# EasyEDA Pro project IPM.eprj

# Schematic Schematic1
Board Name: Board1; Create Date: 2025-09-05; Page Name: P1; Project Name: IPM; Schematic Name: Schematic1; Update Date: 2025-10-12; Company: 嘉立创EDA; Page Size: A4; Version: V1.0
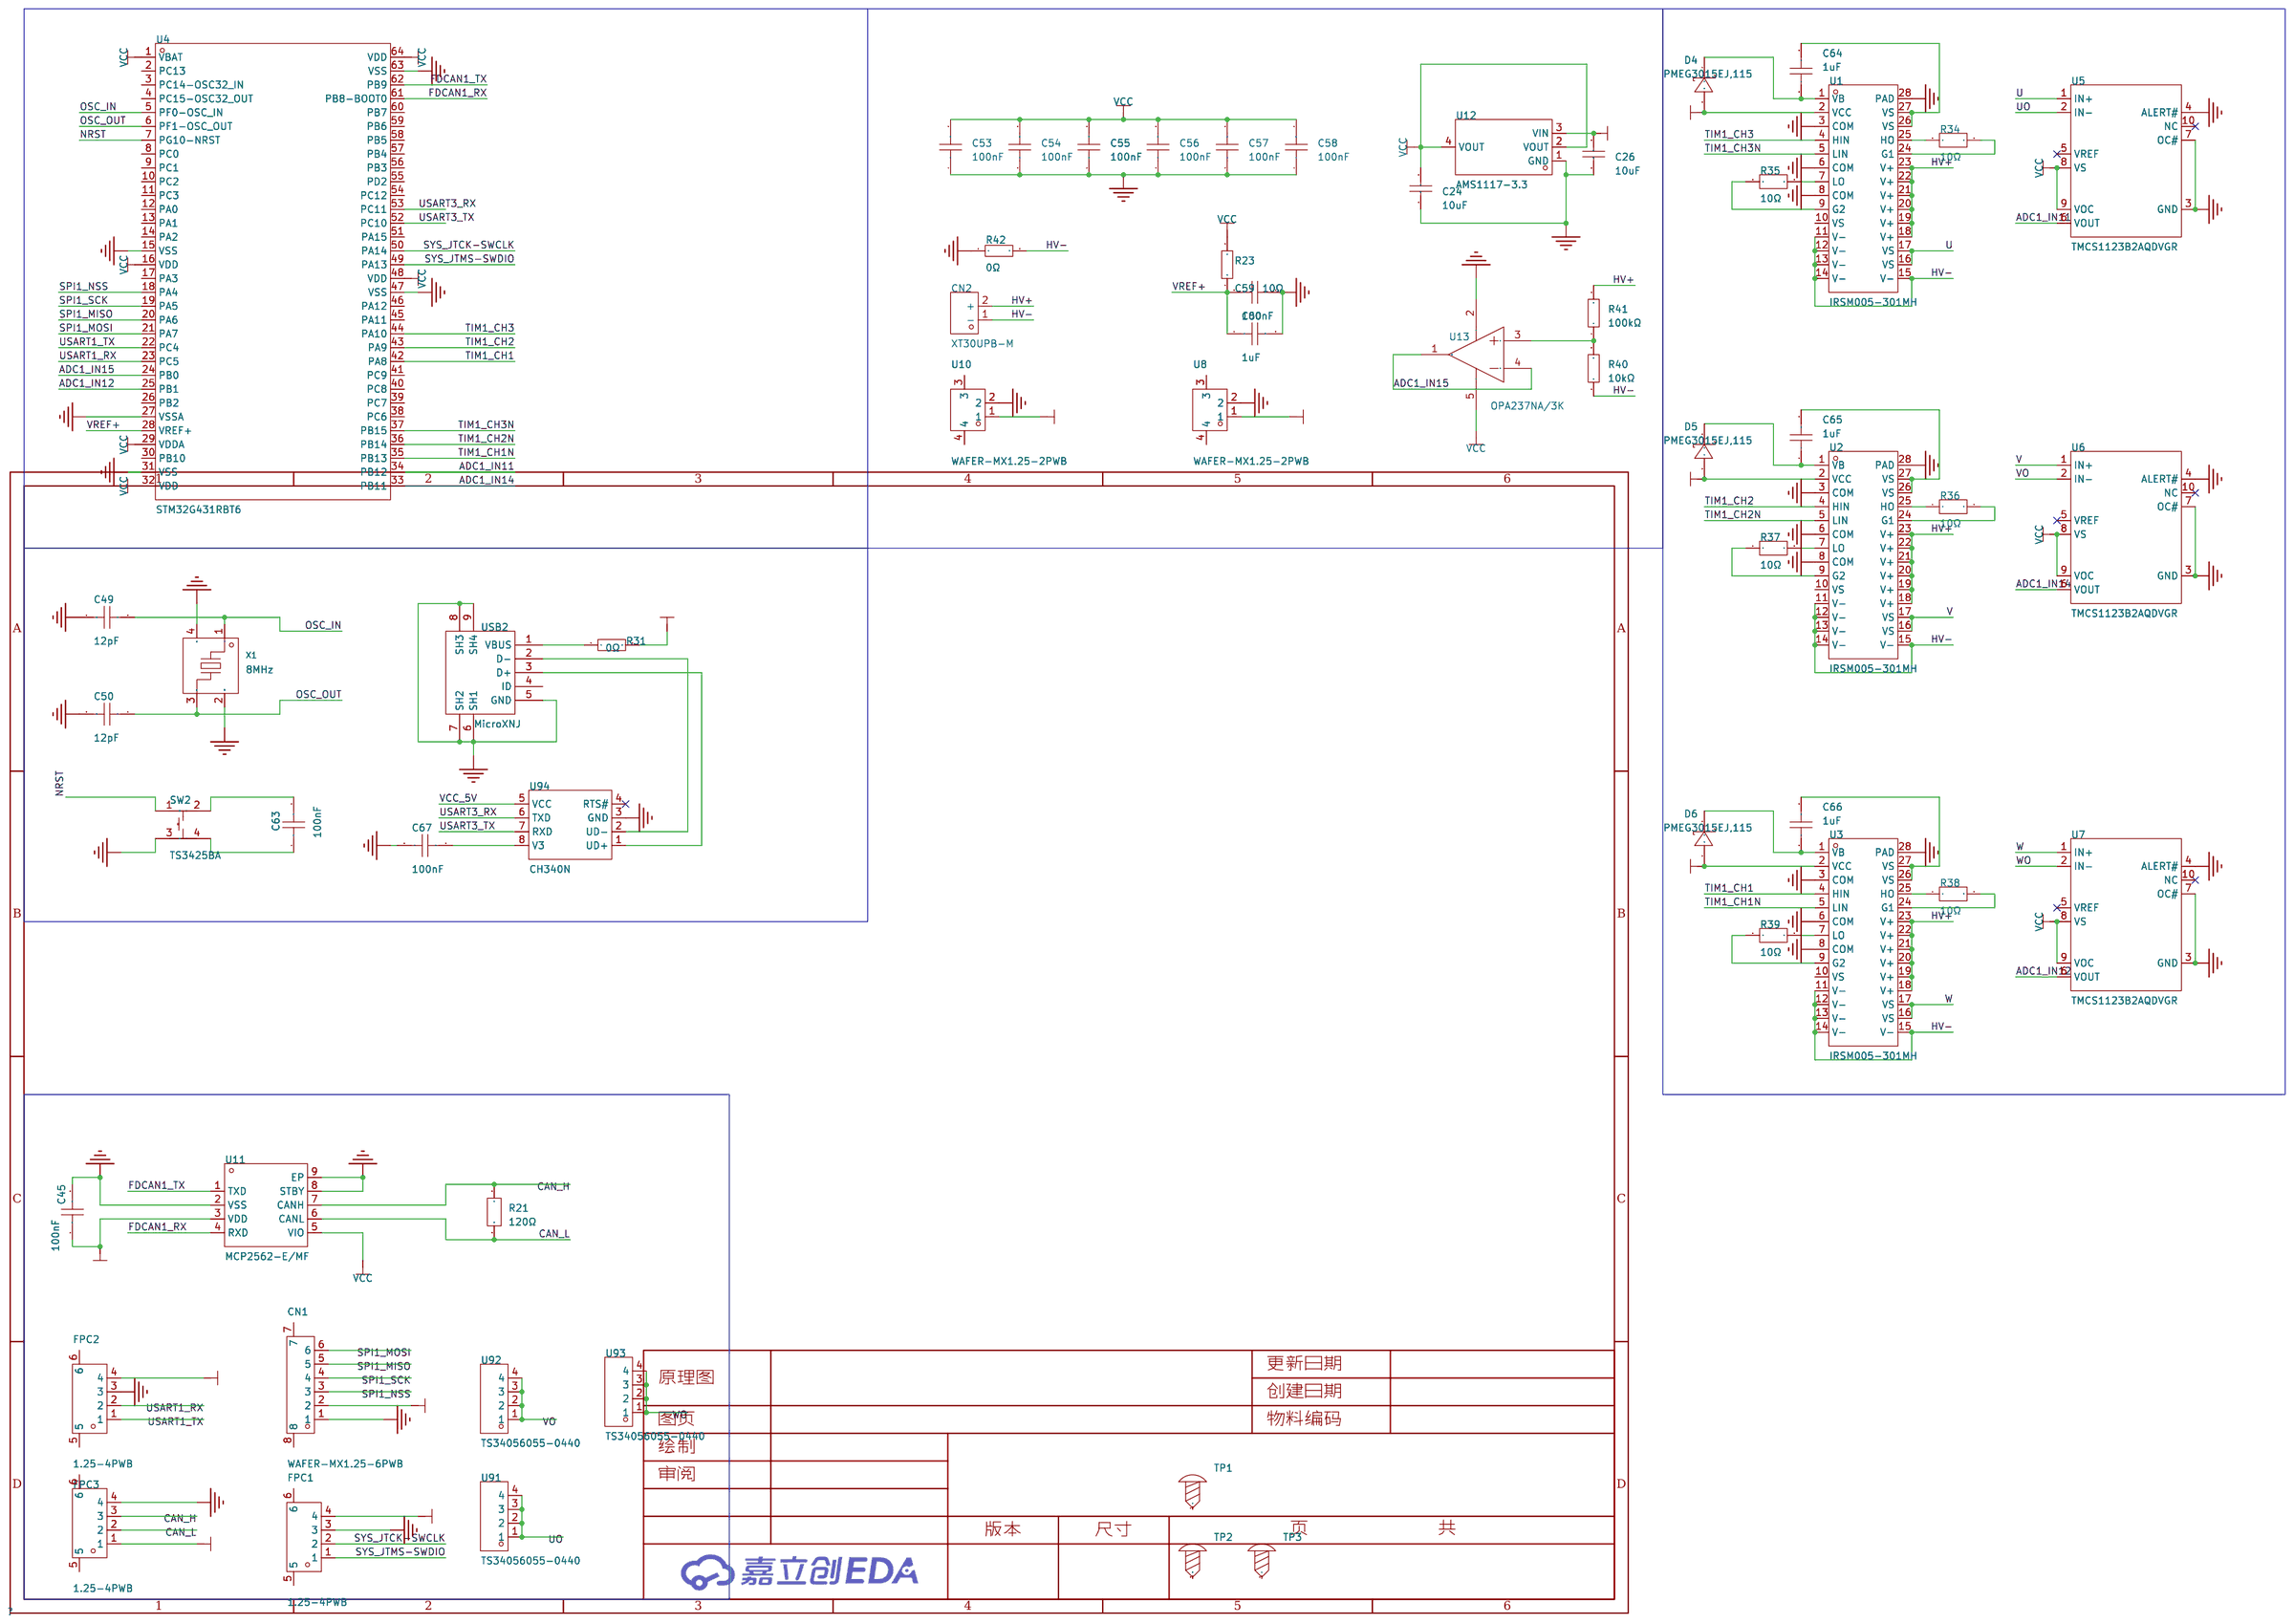
[diagram p0: schematic sheet]

## Parts
C24  10uF  [C0603]
C26  10uF  [C0603]
C45  100nF  [C0603]
C49  12pF  [C0603]
C50  12pF  [C0603]
C53  100nF  [C0603]
C54  100nF  [C0603]
C55  100nF  [C0603]
C56  100nF  [C0603]
C57  100nF  [C0603]
C58  100nF  [C0603]
C59  100nF  [C0603]
C60  1uF  [C0603]
C63  100nF  [C0603]
C64  1uF  [C0603]
C65  1uF  [C0603]
C66  1uF  [C0603]
C67  100nF  [C0603]
CN1  WAFER-MX1.25-6PWB  [CONN-SMD_6P-P1.25_XUNPU_WAFER-MX1.25-6PWB]
CN2  XT30UPB-M  [CONN-TH_XT30UPB-M]
D4  PMEG3015EJ,115  [SOD-323F_L1.7-W1.3-LS2.5-R-RD]
D5  PMEG3015EJ,115  [SOD-323F_L1.7-W1.3-LS2.5-R-RD]
D6  PMEG3015EJ,115  [SOD-323F_L1.7-W1.3-LS2.5-R-RD]
FPC1  1.25-4PWB  [CONN-SMD_1.25-4PWB]
FPC2  1.25-4PWB  [CONN-SMD_1.25-4PWB]
FPC3  1.25-4PWB  [CONN-SMD_1.25-4PWB]
R21  120Ω  [R0603]
R23  10Ω  [R0603]
R31  0Ω  [R0603]
R34  10Ω  [R0603]
R35  10Ω  [R0603]
R36  10Ω  [R0603]
R37  10Ω  [R0603]
R38  10Ω  [R0603]
R39  10Ω  [R0603]
R40  10kΩ  [R0603]
R41  100kΩ  [R0603]
R42  0Ω  [R0805]
SW2  TS3425BA  [SW-SMD_4P-L4.2-W3.2-P2.15-LS4.6-1]
TP1  -  [M2螺丝]
TP2  -  [M2螺丝]
TP3  -  [M2螺丝]
U1  IRSM005-301MH  [PQFN-27_IRSM005-800MHTR]
U2  IRSM005-301MH  [PQFN-27_IRSM005-800MHTR]
U3  IRSM005-301MH  [PQFN-27_IRSM005-800MHTR]
U4  STM32G431RBT6  [LQFP-64_L10.0-W10.0-P0.50-LS12.0-BL]
U5  TMCS1123B2AQDVGR  [SOIC-10_L10.3-W7.5-P1.27-LS10.3-BL]
U6  TMCS1123B2AQDVGR  [SOIC-10_L10.3-W7.5-P1.27-LS10.3-BL]
U7  TMCS1123B2AQDVGR  [SOIC-10_L10.3-W7.5-P1.27-LS10.3-BL]
U8  WAFER-MX1.25-2PWB  [CONN-SMD_2P-P1.25_XUNPU_WAFER-MX1.25-2PWB]
U10  WAFER-MX1.25-2PWB  [CONN-SMD_2P-P1.25_XUNPU_WAFER-MX1.25-2PWB]
U11  MCP2562-E/MF  [DFN-8_L3.0-W3.0-P0.65-BL-EP]
U12  AMS1117-3.3  [SOT-223-3_L6.5-W3.4-P2.30-LS7.0-BR]
U13  OPA237NA/3K  [SOT-23-5_L3.0-W1.7-P0.95-LS2.8-BR]
U91  TS34056055-0440  [SMD-4_TS34056055-0440]
U92  TS34056055-0440  [SMD-4_TS34056055-0440]
U93  TS34056055-0440  [SMD-4_TS34056055-0440]
U94  CH340N  [SOP-8_L4.9-W3.9-P1.27-LS6.0-BL]
USB2  MicroXNJ  [MICRO-USB-SMD_MICROXNJ]
X1  8MHz  [OSC-SMD_4P-L3.2-W2.5-BL]

## Library data of the parts
C24 C26 = 0603X106K100: 容值:10uF;精度:±10%;额定电压:10V;材质(温度系数):X5R;; LCSC Part Name: 10uF ±10% 10V; Supplier Part: C90806; Manufacturer: Walsin(华新科); Supplier Footprint: 0603; JLCPCB Part Class: 扩展库; Datasheet: https://atta.szlcsc.com/upload/public/pdf/source/20170726/C90806_1501054746849844281.pdf; Supplier: LCSC; Tolerance: ±10%; Voltage Rated: 10V; Temperature Coefficient: X5R
C45 C53-C59 C63 = CC0603KRX7R9BB104: 容值:100nF;精度:±10%;额定电压:50V;材质(温度系数):X7R;; LCSC Part Name: 100nF ±10% 50V; Supplier Part: C14663; Manufacturer: YAGEO(国巨); Supplier Footprint: 0603; JLCPCB Part Class: 基础库; Datasheet: https://atta.szlcsc.com/upload/public/pdf/source/20180910/C282072_33301C7F631E79921B82A8DAC6BCC5B3.pdf; Supplier: LCSC; Tolerance: ±10%; Voltage Rated: 50V; Temperature Coefficient: X7R
C49 C50 = CC0603FRNPO9BN120: 容值:12pF;精度:±1%;额定电压:50V;材质(温度系数):NP0;; LCSC Part Name: 12pF ±1% 50V; Supplier Part: C519482; Manufacturer: YAGEO(国巨); Supplier Footprint: 0603; JLCPCB Part Class: Extended Part; Datasheet: https://atta.szlcsc.com/upload/public/pdf/source/20200423/C519482_89049CE53433C44DEC6365B4D6A7EBAA.pdf; Supplier: LCSC; Tolerance: ±1%; Voltage Rated: 50V; Temperature Coefficient: NP0
C60 = CC0603JRX7R6BB105: 容值:1uF;精度:±5%;额定电压:10V;材质(温度系数):X7R;; LCSC Part Name: 1uF ±5% 10V; Supplier Part: C519559; Manufacturer: YAGEO(国巨); Supplier Footprint: 0603; JLCPCB Part Class: Extended Part; Datasheet: https://atta.szlcsc.com/upload/public/pdf/source/20200423/C519559_6C4B5FFAE74A7C54887BF5D296B4B550.pdf; Supplier: LCSC; Tolerance: ±5%; Voltage Rated: 10V; Temperature Coefficient: X7R
C64-C66 = CL10A105KB8NNNC: LCSC Part Name: 1uF ±10% 50V; Supplier Part: C15849; Manufacturer: SAMSUNG(三星); Supplier Footprint: 0603; JLCPCB Part Class: 基础库; Datasheet: https://item.szlcsc.com/datasheet/CL10A105KB8NNNC/16531.html; Supplier: LCSC; Tolerance: ±10%; Voltage Rating: 50V; Temperature Coefficient: X5R
C67 = FCC0603B104K500CT: 容值:100nF;精度:±10%;额定电压:50V;温度系数:X7R;; LCSC Part Name: 100nF ±10% 50V; Supplier Part: C5137636; Manufacturer: FOJAN(富捷); Supplier Footprint: 0603; JLCPCB Part Class: 扩展库; Datasheet: https://item.szlcsc.com/datasheet/FCC0603B104K500CT/5747088.html; Supplier: LCSC; Tolerance: ±10%; Voltage Rating: 50V; Temperature Coefficient: X7R
CN1 = WAFER-MX1.25-6PWB: LCSC Part Name: 1x6P 间距:1.25mm 卧贴 系列:PicoBlade(MX 1.25); Supplier Part: C3029363; Manufacturer: XUNPU(讯普); Supplier Footprint: SMD,P=1.25mm,卧贴; JLCPCB Part Class: 扩展库; Datasheet: https://item.szlcsc.com/datasheet/WAFER-MX1.25-6PWB/3561375.html; Supplier: LCSC; Pins Structure: 1x6P; Pitch: 1.25mm; Mounting Type: 卧贴; Reference Series: PicoBlade(MX 1.25); Number of Pins: 6P; Number of Rows: 1; Number of PINs Per Row: 6; Current Rating: 1A; Contact Material: 黄铜; Operating Temperature: -25℃~+85℃; Voltage Rating: 125V; Plastic Material: LCP; Supplementary Features: 辅助焊脚; Color: 米色; Z-Height of the Board: 3.6mm; X-Length of Bottom Edge on Board (Spacing Line): 12.5mm; Y-Width of Bottom Edge on Board: 5.25mm
CN2 = XT30UPB-M: LCSC Part Name: AMASS(艾迈斯)板载立式 航模锂电池控制器连接器插头 公头XT30UPB-M; Supplier Part: C428721; Manufacturer: AMASS(艾迈斯); JLCPCB Part Class: 扩展库; Datasheet: https://item.szlcsc.com/datasheet/XT30UPB-M/423831.html; Supplier: LCSC; Type: 航模插头; Colour: 黄色; RatedVoltage: DC 500V; InterfaceType: 公头; MetalMaterial: 镀金; InsulationMaterial: PA; RatedCurrent: 15A; contact resistance: 0.65mΩ
D4-D6 = PMEG3015EJ,115: LCSC Part Name: 电压:30V 电流:1.5A; Supplier Part: C426865; Manufacturer: Nexperia(安世); Supplier Footprint: SOD-323F; JLCPCB Part Class: 扩展库; Datasheet: https://item.szlcsc.com/datasheet/PMEG3015EJ%252C115/420884.html; Supplier: LCSC; Diode Configuration: 1个独立式; Voltage - Forward(Vf@If): 550mV@1.5A; Voltage - DC Reverse(Vr): 30V; Current - Rectified: 1.5A; Reverse Leakage Current (Ir): 1mA@30V; Non-Repetitive Peak Forward Surge Current: 9A
FPC1-FPC3 = 1.25-4PWB: LCSC Part Name: 1x4P 间距:1.25mm 卧贴 系列:PicoBlade(MX 1.25); Supplier Part: C2905011; Manufacturer: DEALON(德艺隆); Supplier Footprint: SMD,P=1.25mm,卧贴; JLCPCB Part Class: 扩展库; Datasheet: https://item.szlcsc.com/datasheet/1.25-4PWB/3172296.html; Supplier: LCSC; Pins Structure: 1x4P; Pitch: 1.25mm; Mounting Type: 卧贴; Reference Series: PicoBlade(MX 1.25); Number of Pins: 4P; Number of Rows: 1; Number of PINs Per Row: 4; Current Rating: 1A; Contact Material: 黄铜; Contact Plating: 锡; Operating Temperature: -25℃~+85℃; Voltage Rating: 125V; Plastic Material: LCP; Flame Retardant Rating: UL94V-0; Supplementary Features: 辅助焊脚; Color: 米色
R21 = AR03BTCX1200: 电阻类型:薄膜电阻;阻值:120Ω;精度:±0.1%;功率:100mW;; LCSC Part Name: 120Ω ±0.1% 100mW; Supplier Part: C2828631; Manufacturer: Viking(光颉); Supplier Footprint: 0603; JLCPCB Part Class: 扩展库; Datasheet: https://atta.szlcsc.com/upload/public/pdf/source/20211009/C2828631_CB7E5025206F65E2B3DE5440F8A20222.pdf; Supplier: LCSC; Type: 薄膜电阻; Tolerance: ±0.1%; Power(Watts): 100mW; Temperature Coefficient: ±25ppm/℃; Overload Voltage (Max): 50V; Operating Temperature Range: -55℃~+155℃
R23 = 0603WAF100JT5E: 电阻类型:厚膜电阻;阻值:10Ω;精度:±1%;功率:100mW;; LCSC Part Name: 10Ω ±1% 100mW; Supplier Part: C22859; Manufacturer: UNI-ROYAL(厚声); Supplier Footprint: 0603; JLCPCB Part Class: 基础库; Datasheet: https://atta.szlcsc.com/upload/public/pdf/source/20200306/C422600_1E6D84923E4A46A82E41ADD87F860B5C.pdf; Supplier: LCSC; Type: 厚膜电阻; Tolerance: ±1%; Power(Watts): 100mW; Temperature Coefficient: ±400ppm/℃; Overload Voltage (Max): 75V; Operating Temperature Range: -55℃~+155℃
R31 = 0603WAF0000T5E: 电阻类型:厚膜电阻;阻值:0Ω;精度:±1%;功率:100mW;最大工作电压:75V;; LCSC Part Name: 0Ω ±1% 100mW 厚膜电阻; Supplier Part: C21189; Manufacturer: UNI-ROYAL(厚声); Supplier Footprint: 0603; JLCPCB Part Class: 基础库; Datasheet: https://atta.szlcsc.com/upload/public/pdf/source/20200306/C422600_1E6D84923E4A46A82E41ADD87F860B5C.pdf; Supplier: LCSC; Type: 厚膜电阻; Tolerance: ±1%; Power(Watts): 100mW; Overload Voltage (Max): 75V; Operating Temperature Range: -55℃~+155℃
R34-R39 = HoARG0603-1/10W-10R-0.1%-TCR25: LCSC Part Name: 陶瓷电阻 10Ω ±0.1% 100mW; Supplier Part: C5123611; Manufacturer: Milliohm(毫欧); Supplier Footprint: 0603; JLCPCB Part Class: 扩展库; Datasheet: https://atta.szlcsc.com/upload/public/pdf/source/20220810/6C2B79E0158B8955D0E7C03ADBB11263.pdf; Supplier: LCSC; Type: 陶瓷电阻; Tolerance: ±0.1%; Power(Watts): 100mW; Temperature Coefficient: ±25ppm/℃
R40 = RT0603BRD0710KL: LCSC Part Name: 薄膜电阻 10kΩ ±0.1% 100mW; Supplier Part: C95204; Manufacturer: YAGEO(国巨); Supplier Footprint: 0603; JLCPCB Part Class: 扩展库; Datasheet: https://atta.szlcsc.com/upload/public/pdf/source/20250609/0E6D5617EADA80FA3B707391883DF2D5.pdf; Supplier: LCSC; Type: 薄膜电阻; Tolerance: ±0.1%; Power(Watts): 100mW; Voltage-Supply(Max): 75V; Temperature Coefficient: ±25ppm/℃; Operating Temperature: -55℃~+155℃
R41 = RT0603BRD07100KL: LCSC Part Name: 薄膜电阻 100kΩ ±0.1% 100mW; Supplier Part: C122538; Manufacturer: YAGEO(国巨); Supplier Footprint: 0603; JLCPCB Part Class: 扩展库; Datasheet: https://atta.szlcsc.com/upload/public/pdf/source/20170721/C122538_1500619326323834092.pdf; Supplier: LCSC; Type: 薄膜电阻; Tolerance: ±0.1%; Power(Watts): 100mW; Overload Voltage (Max): 75V; Temperature Coefficient: ±25ppm/℃; Operating Temperature Range: -55℃~+155℃
R42 = 0805W8F0000T5E: LCSC Part Name: 0Ω ±1% 125mW 厚膜电阻; Supplier Part: C17477; Manufacturer: UNI-ROYAL(厚声); Supplier Footprint: 0805; JLCPCB Part Class: 基础库; Datasheet: https://item.szlcsc.com/datasheet/0805W8F0000T5E/18165.html; Supplier: LCSC; Type: 厚膜电阻; Tolerance: ±1%; Power(Watts): 125mW; Voltage-Supply(Max): 150V; Temperature Coefficient: ±800ppm/℃; Operating Temperature: -55℃~+155℃
SW2 = TS3425BA: LCSC Part Name: 4.2*3.2*2.5mm 立贴 轻触开关; Supplier Part: C2681476; Manufacturer: SHOU HAN(首韩); Supplier Footprint: SMD; JLCPCB Part Class: 扩展库; Datasheet: https://item.szlcsc.com/datasheet/TS3425BA/2774819.html; Supplier: LCSC; Circuit: 单刀单掷; Actuator Style: 椭圆形按钮; Operating Force: 2.5N; Mounting Type: 立贴; Length: 4.2mm; Width: 3.2mm; Switch Height: 2.5mm; with Bracket: 不带支架; Contact Current: 50mA; Voltage Rating: 12V; Actuator/Cap Color: 白色; Termination Style: J型引脚; Life: 10万次; Operating Temperature: -20℃~+85℃
TP1-TP3 = M2螺丝: Supplier Footprint: 插件
U1-U3 = IRSM005-301MH: Supplier Part: C538363; Manufacturer: Infineon(英飞凌); Supplier Footprint: PQFN-27; JLCPCB Part Class: 扩展库; Datasheet: https://item.szlcsc.com/datasheet/IRSM005-301MH/558706.html; Supplier: LCSC; Driven Configuration: 半桥; Load Type: MOSFET; Number of Drivers: 2; Voltage - Supply: 10V~20V; Rise Time: 70ns; Fall Time: 35ns; Propagation Delay tpLH: 160ns; Propagation Delay tpHL: 150ns; Features: 欠压保护(UVP); Quiescent Current(Iq): 150uA
U4 = STM32G431RBT6: LCSC Part Name: 带DSP和FPU的170MHz主流ARM Cortex-M4 MCU，具有128 KB Flash存储器、数学加速器和中等模拟电平集成; Supplier Part: C431633; Manufacturer: ST(意法半导体); Supplier Footprint: LQFP-64(10x10); JLCPCB Part Class: 扩展库; Datasheet: https://item.szlcsc.com/datasheet/STM32G431RBT6/428111.html; Supplier: LCSC; CPU Core: ARM-M系列; CPU Maximum Speed: 170MHz; Program Storage Size: 128KB; Number of I/O: 52; ADC (Bit): 12bit; DAC (Bit): 12bit; Voltage - Supply: 1.71V~3.6V
U5-U7 = TMCS1123B2AQDVGR: Supplier Part: C34837986; Manufacturer: TI(德州仪器); Supplier Footprint: SOIC-10; JLCPCB Part Class: 扩展库; Datasheet: https://www.ti.com.cn/cn/lit/ds/symlink/tmcs1123.pdf?ts=1749086202716; Supplier: LCSC
U8 U10 = WAFER-MX1.25-2PWB: LCSC Part Name: 1x2P 间距:1.25mm 卧贴 系列:PicoBlade(MX 1.25); Supplier Part: C3029359; Manufacturer: XUNPU(讯普); Supplier Footprint: SMD,P=1.25mm,卧贴; JLCPCB Part Class: 扩展库; Datasheet: https://atta.szlcsc.com/upload/public/pdf/source/20220527/5ACBB683E384B6AD06743F272F933620.pdf; Supplier: LCSC; Pins Structure: 1x2P; Pitch: 1.25mm; Mounting Type: 卧贴; Reference Series: PicoBlade(MX 1.25); Number of Pins: 2P; Number of Rows: 1; Number of PINs Per Row: 2; Current Rating: 1A; Contact Material: 黄铜; Operating Temperature: -25℃~+85℃; Voltage Rating: 125V; Plastic Material: LCP; Supplementary Features: 辅助焊脚; Color: 米色; Z-Height of the Board: 3.6mm; X-Length of Bottom Edge on Board (Spacing Line): 7.5mm; Y-Width of Bottom Edge on Board: 5.25mm
U11 = MCP2562-E/MF: 类型:收发器;; Supplier Part: C635113; Manufacturer: MICROCHIP(美国微芯); Supplier Footprint: DFN-8-EP(3x3); JLCPCB Part Class: 扩展库; Datasheet: https://atta.szlcsc.com/upload/public/pdf/source/20150713/1457707330677.pdf; Supplier: LCSC; Type: 收发器; Supply Voltage: 4.5V~5.5V; Operating Temperature: -40℃~+125℃
U12 = AMS1117-3.3_C6186: 输出类型:固定;输出极性:正;最大输入电压:-;输出电压:3.3V;输出电流:1A;电源纹波抑制比(PSRR):72dB@(120Hz);; LCSC Part Name: 输出3.3V 1A; Supplier Part: C6186; Manufacturer: AMS; Supplier Footprint: SOT-223; JLCPCB Part Class: 基础库; Datasheet: https://atta.szlcsc.com/upload/public/pdf/source/20180727/C6186_7A095716F0823C02F1997A905E26C086.pdf; Supplier: LCSC; Output Type: 固定; Output Polarity: 正; Number of Outputs: 1; Output Voltage: 3.3V; Dropout Voltage: 1.3V@(800mA); Output Current: 1A; Power Supply Rejection Ratio (PSRR): 72dB@(120Hz)
U13 = OPA237NA/3K: Supplier Part: C90349; Manufacturer: TI(德州仪器); Supplier Footprint: SOT-23-5; JLCPCB Part Class: 扩展库; Datasheet: https://www.ti.com/cn/lit/gpn/opa2237; Supplier: LCSC; Number of Channels: 单路; Gain Bandwidth Product: 1.5MHz; Ib - Input Bias Current: 10nA; Vos - Input Offset Voltage: 250uV; Common Mode Rejection Ratio(CMRR): 85dB; Slew Rate: 0.5V/us; Output Current: 4mA; Rail to Rail: 轨到轨输入,轨到轨输出; Input Offset Voltage Drift(Vos TC): 2uV/℃; Quiescent Current(Iq): 350uA; Operating Temperature: -40℃~+85℃; Single Supply: 2.7V~36V; Dual Supply: -18V~-1.35V；1.35V~18V; Maximum Power Supply Range (Vdd-Vss): 36V; Noise density(eN): 28nV/√Hz@1kHz; Input Offset Current(Ios): 10nA
U91-U93 = TS34056055-0440: 螺孔规格:M3;焊脚数量:4;; LCSC Part Name: PCB焊接端子抽牙立贴M3 四脚 10*5.5*4.4mm T0.8 镀雾锡; Supplier Part: C19724594; Manufacturer: XFCN(兴飞); Supplier Footprint: SMD; JLCPCB Part Class: 扩展库; Datasheet: https://atta.szlcsc.com/upload/public/pdf/source/20231225/0D4D7DBADB53D24178026D9F36264268.pdf; Supplier: LCSC; Screw Hole Size: M3; Number of Leg: 4
U94 = CH340N: LCSC Part Name: USB2.0芯片CH340; Supplier Part: C2977777; Manufacturer: WCH(南京沁恒); Supplier Footprint: SOP-8; JLCPCB Part Class: 扩展库; Datasheet: https://atta.szlcsc.com/upload/public/pdf/source/20240313/115CDE92081B1D6CB446704AD5D0F5F2.pdf; Supplier: LCSC; Applications Function: USB转串口; Protocol: USB 2.0; Number of Channels: 1; Voltage - Supply: 3.3V；5V; Data Rate: 2Mbps; Operating Temperature: -20℃~+70℃
USB2 = MicroXNJ: 连接器类型:Micro-B;标准:USB 2.0;公母:母;安装方式:卧贴;触点数量:5P;端口数量:1;额定电流 - 电源:1A;工作温度范围:-20℃~+85℃;; LCSC Part Name: Micro-B 母 卧贴; Supplier Part: C404969; Manufacturer: SHOU HAN(首韩); Supplier Footprint: SMD; JLCPCB Part Class: 扩展库; Datasheet: https://atta.szlcsc.com/upload/public/pdf/source/20220415/2494EDFF499AF6F852F7C820374B6AF3.pdf; Supplier: LCSC; Connector Type: Micro-B; Standard: USB 2.0; Gender: 母; Mounting Style: 卧贴; Number of Contacts: 5P; Number of Ports: 1; Current Rating - Power (Max): 1A; Operating Temperature Range: -20℃~+85℃
X1 = X32258MOB4SI: 频率:8MHz;频率公差:±10ppm;负载电容:12pF;; LCSC Part Name: 8MHz ±10ppm 12pF YSX321SL; Supplier Part: C2682775; Manufacturer: YXC(扬兴晶振); Supplier Footprint: SMD3225-4P; JLCPCB Part Class: Extended Part; Datasheet: https://atta.szlcsc.com/upload/public/pdf/source/20210106/C2682774_0CD4FDA5D9DA3FBEEC23BD607A48E4B0.pdf; Supplier: LCSC; Crystal Type: 贴片无源晶振; Frequency Tolerance: ±10ppm; Frequency Stability: ±30ppm; Load Capacitance: 12pF; Equivalent Series Resistance (ESR): 150Ω; Operating Temperature: -40℃~+85℃

## Nets
GND: C24.2 C26.2 C45.2 C49.2 C50.2 C53.1 C54.1 C55.1 C56.1 C57.1 C58.1 C59.1 C60.2 C67.1 CN1.1 FPC1.3 FPC2.3 FPC3.4 R42.1 SW2.3 U1.3(COM) U1.6(COM) U1.8(COM) U1.28(PAD) U2.3(COM) U2.6(COM) U2.8(COM) U2.28(PAD) U3.3(COM) U3.6(COM) U3.8(COM) U3.28(PAD) U4.15(VSS) U4.27(VSSA) U4.31(VSS) U4.47(VSS) U4.63(VSS) U5.3(GND) U5.4(ALERT#) U5.7(OC#) U6.3(GND) U6.4(ALERT#) U6.7(OC#) U7.3(GND) U7.4(ALERT#) U7.7(OC#) U8.2 U10.2 U11.2(VSS) U11.8(STBY) U11.9(EP) U12.1(GND) U13.2(V-) U94.3(GND) USB2.5(GND) USB2.6(SH1) USB2.7(SH2) USB2.8(SH3) USB2.9(SH4) X1.2(GND) X1.4(GND)
VCC: C24.1 C53.2 C54.2 C55.2 C56.2 C57.2 C58.2 R23.2 U4.1(VBAT) U4.16(VDD) U4.29(VDDA) U4.32(VDD) U4.48(VDD) U4.64(VDD) U5.8(VS) U5.9(VOC) U6.8(VS) U6.9(VOC) U7.8(VS) U7.9(VOC) U11.5(VIO) U12.2(VOUT) U12.4(VOUT) U13.5(V+)
VCC_5V: C26.1 C45.1 CN1.2 FPC1.4 FPC2.4 FPC3.1 R31.2 U8.1 U11.3(VDD) U12.3(VIN) U94.5(VCC)
VCC_15V: D4.2 D5.2 D6.2 U1.2(VCC) U2.2(VCC) U3.2(VCC) U10.1
ADC1_IN11: U4.34(PB12) U5.6(VOUT)
ADC1_IN12: U4.25(PB1) U7.6(VOUT)
ADC1_IN14: U4.33(PB11) U6.6(VOUT)
ADC1_IN15: U4.24(PB0) U13.1(OUT) U13.4(IN-)
CAN_H: FPC3.3 R21.2 U11.7(CANH)
CAN_L: FPC3.2 R21.1 U11.6(CANL)
FDCAN1_RX: U4.61(PB8-BOOT0) U11.4(RXD)
FDCAN1_TX: U4.62(PB9) U11.1(TXD)
HV+: CN2.2(+) R41.2 U1.18(V+) U1.19(V+) U1.20(V+) U1.21(V+) U1.22(V+) U1.23(V+) U2.18(V+) U2.19(V+) U2.20(V+) U2.21(V+) U2.22(V+) U2.23(V+) U3.18(V+) U3.19(V+) U3.20(V+) U3.21(V+) U3.22(V+) U3.23(V+)
HV-: CN2.1(-) R40.1 R42.2 U1.11(V-) U1.12(V-) U1.13(V-) U1.14(V-) U1.15(V-) U2.11(V-) U2.12(V-) U2.13(V-) U2.14(V-) U2.15(V-) U3.11(V-) U3.12(V-) U3.13(V-) U3.14(V-) U3.15(V-)
NRST: SW2.1 U4.7(PG10-NRST)
OSC_IN: C49.1 U4.5(PF0-OSC_IN) X1.1
OSC_OUT: C50.1 U4.6(PF1-OSC_OUT) X1.3
SPI1_MISO: CN1.5 U4.20(PA6)
SPI1_MOSI: CN1.6 U4.21(PA7)
SPI1_NSS: CN1.3 U4.18(PA4)
SPI1_SCK: CN1.4 U4.19(PA5)
SYS_JTCK-SWCLK: FPC1.2 U4.50(PA14)
SYS_JTMS-SWDIO: FPC1.1 U4.49(PA13)
TIM1_CH1: U3.4(HIN) U4.42(PA8)
TIM1_CH1N: U3.5(LIN) U4.35(PB13)
TIM1_CH2: U2.4(HIN) U4.43(PA9)
TIM1_CH2N: U2.5(LIN) U4.36(PB14)
TIM1_CH3: U1.4(HIN) U4.44(PA10)
TIM1_CH3N: U1.5(LIN) U4.37(PB15)
U: U1.16(VS) U1.17(VS) U5.1(IN+)
UO: U5.2(IN-) U91.1 U91.2 U91.3 U91.4
USART1_RX: FPC2.2 U4.23(PC5)
USART1_TX: FPC2.1 U4.22(PC4)
USART3_RX: U4.53(PC11) U94.6(TXD)
USART3_TX: U4.52(PC10) U94.7(RXD)
V: U2.16(VS) U2.17(VS) U6.1(IN+)
VO: U6.2(IN-) U92.1 U92.2 U92.3 U92.4
VREF+: C59.2 C60.1 R23.1 U4.28(VREF+)
W: U3.16(VS) U3.17(VS) U7.1(IN+)
WO: U7.2(IN-) U93.1 U93.2 U93.3 U93.4
$1N2757: C63.2 SW2.2
$1N2759: C63.1 SW2.4
$1N4046: R31.1 USB2.1(VBUS)
$1N8993: C64.1 D4.1 U1.1(VB)
$1N9003: C64.2 U1.26(VS) U1.27(VS)
$1N9475: C65.2 U2.26(VS) U2.27(VS)
$1N9480: C65.1 D5.1 U2.1(VB)
$1N9569: C66.2 U3.26(VS) U3.27(VS)
$1N9574: C66.1 D6.1 U3.1(VB)
$1N9829: R34.1 U1.25(HO)
$1N9852: R34.2 U1.24(G1)
$1N9858: R35.2 U1.7(LO)
$1N9862: R35.1 U1.9(G2)
$1N9872: R36.1 U2.25(HO)
$1N9876: R36.2 U2.24(G1)
$1N9891: R37.2 U2.7(LO)
$1N9895: R37.1 U2.9(G2)
$1N9905: R39.2 U3.7(LO)
$1N9909: R39.1 U3.9(G2)
$1N9916: R38.1 U3.25(HO)
$1N9921: R38.2 U3.24(G1)
$1N13308: R40.2 R41.1 U13.3(IN+)
$1N17919: U94.1(UD+) USB2.3(D+)
$1N17922: U94.2(UD-) USB2.2(D-)
$1N18063: C67.2 U94.8(V3)

Not connected (* = marked no-connect by the designer): CN1 7 8; FPC1 5 6; FPC2 5 6; FPC3 5 6; TP1 1; TP2 1; TP3 1; U1 10(VS); U2 10(VS); U3 10(VS); U4 2(PC13) 3(PC14-OSC32_IN) 4(PC15-OSC32_OUT) 8(PC0) 9(PC1) 10(PC2) 11(PC3) 12(PA0) 13(PA1) 14(PA2) 17(PA3) 26(PB2) 30(PB10) 38(PC6) 39(PC7) 40(PC8) 41(PC9) 45(PA11) 46(PA12) 51(PA15) 54(PC12) 55(PD2) 56(PB3) 57(PB4) 58(PB5) 59(PB6) 60(PB7); U5 5(VREF)* 10(NC)*; U6 5(VREF)* 10(NC)*; U7 5(VREF)* 10(NC)*; U8 3 4; U10 3 4; U94 4(RTS#)*; USB2 4(ID)

# Board PCB1
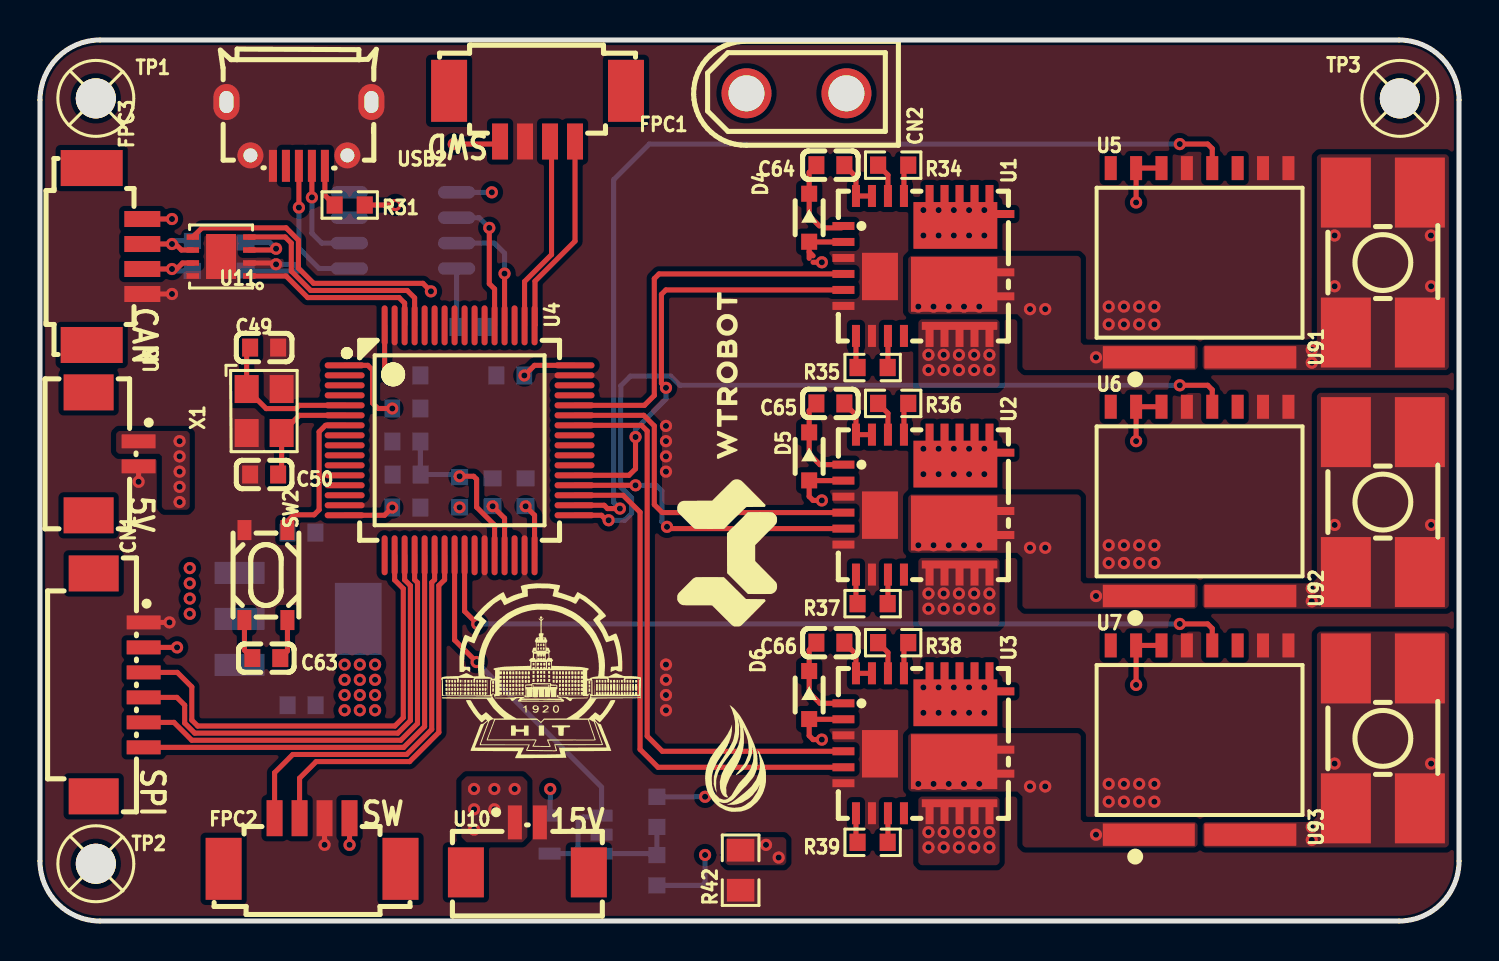
[diagram p1: board, top side]
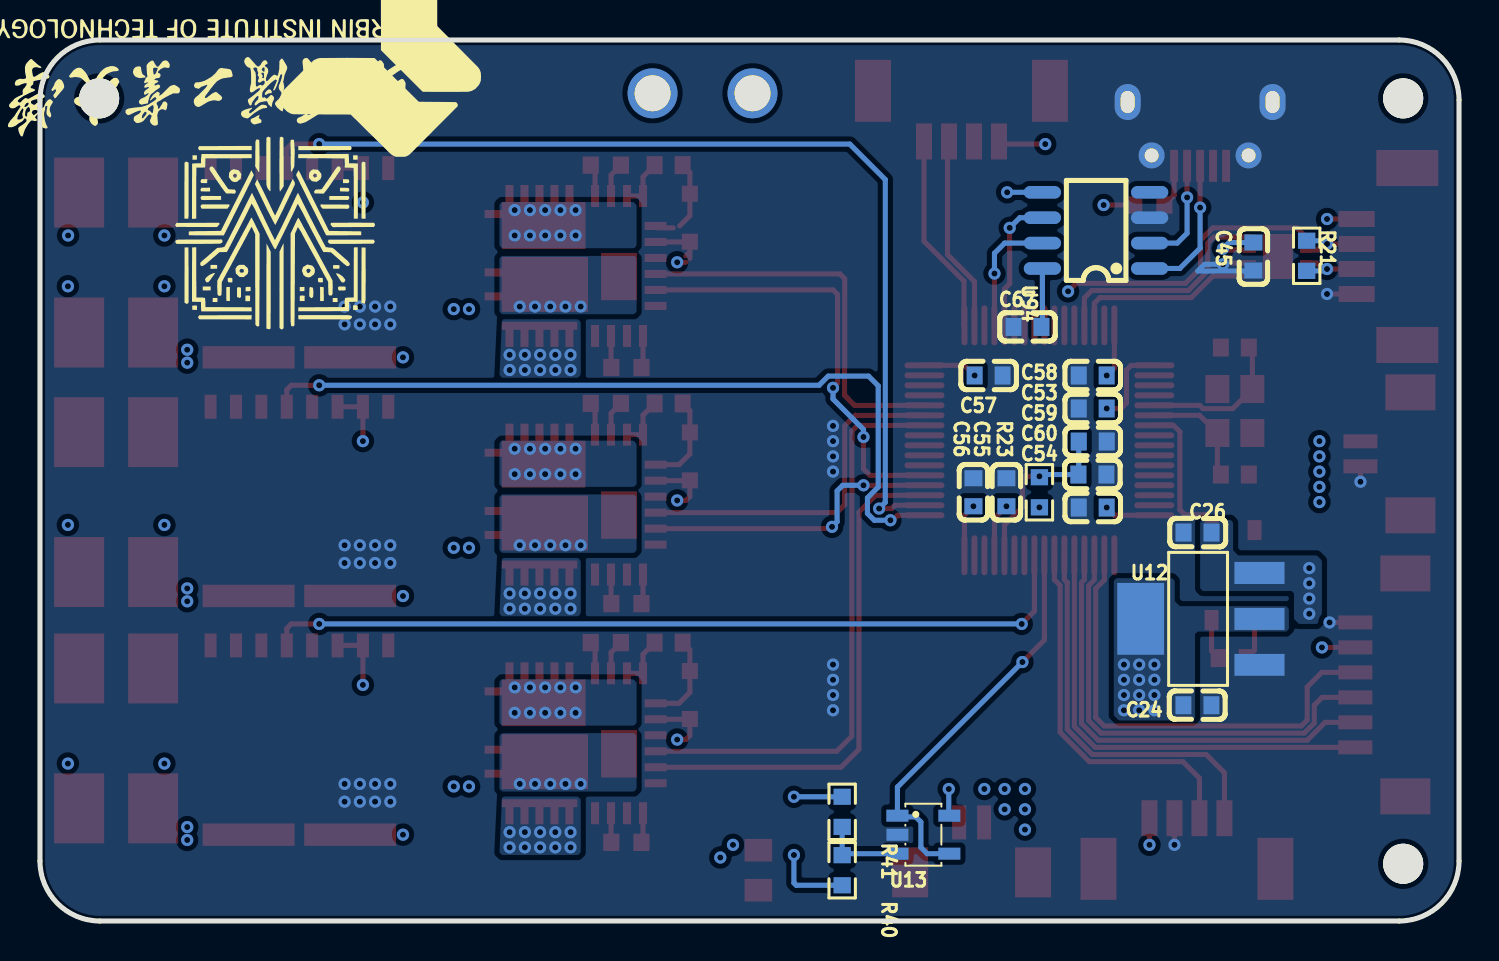
[diagram p2: board, bottom side, seen from below]

Outline 70.99 x 44.07 mm; copper layers: Top Layer, Inner1, Inner2, Inner3, Inner4, Bottom Layer. Coordinates in mm from the lower left corner of the outline.
Outline path: 0,41.07 0,3 arc(0.88,0.88) 3,0 67.99,0 arc(70.11,0.88) 70.99,3 70.99,41.07 arc(70.11,43.19) 67.99,44.07 3,44.07 arc(0.88,43.19) 0,41.07
Stack: Top Layer 0.035mm 外层铜厚1oz / Dielectric1 0.0994mm 3313 RC57% 4.2mil / Inner1 0.0152mm 内层铜厚 / Dielectric2 0.55mm 0.55mm H/H No copper / Inner2 0.0152mm 内层铜厚 / Dielectric3 0.1088mm 2116 RC54% 4.9mil / Inner3 0.0152mm 内层铜厚 / Dielectric4 0.55mm 0.55mm H/H No copper / Inner4 0.0152mm 内层铜厚 / Dielectric5 0.0994mm 3313 RC57% 4.2mil / Bottom Layer 0.035mm 外层铜厚1oz

## Design rules (mm)
template: 自定义配置
spacing copperThickness1oz (default): track to track 0.102, other pairs 0.152 to 0.3
spacing copperThickness2oz: track to track 0.203, other pairs 0.152 to 0.3
track width copperThickness1oz (default): min 0.127, default 0.254, max 2.54
track width copperThickness2oz: min 0.203, default 0.254, max 2.54
differential pair differentialPair (default): width min 0.127, default 0.254, max 2.54; gap min 0.152, default 0.152
via viaSize (default): diameter min 0.5, default 0.61, max 10; hole min 0.3, default 0.305, max 6.3
net HV+ uses copperRegion1
net GND uses copperRegion1
net VCC uses copperRegion1
net HV- uses copperRegion1
net U uses copperRegion1
net UO uses copperRegion1
net V uses copperRegion1
net W uses copperRegion1
net VO uses copperRegion1
net WO uses copperRegion1
net VCC_15V uses copperRegion1
net VCC_5V uses copperRegion1

## Placement (name value [footprint] x y rotation side)
C24  10uF  [C0603]  13.09 10.79 180 bottom
C26  10uF  [C0603]  13.08 19.43 0 bottom
C45  100nF  [C0603]  10.29 33.24 270 bottom
C49  12pF  [C0603]  11.21 28.68 0 top
C50  12pF  [C0603]  11.21 22.33 180 top
C53  100nF  [C0603]  18.33 25.64 180 bottom
C54  100nF  [C0603]  18.33 20.68 180 bottom
C55  100nF  [C0603]  22.64 21.44 270 bottom
C56  100nF  [C0603]  24.29 21.44 270 bottom
C57  100nF  [C0603]  23.53 27.29 0 bottom
C58  100nF  [C0603]  18.33 27.29 180 bottom
C59  100nF  [C0603]  18.33 23.98 0 bottom
C60  1uF  [C0603]  18.34 22.33 180 bottom
C63  100nF  [C0603]  11.32 13.15 0 top
C64  1uF  [C0603]  39.54 37.81 0 top
C65  1uF  [C0603]  39.54 25.89 0 top
C66  1uF  [C0603]  39.54 13.92 0 top
C67  100nF  [C0603]  21.59 29.72 180 bottom
CN1  WAFER-MX1.25-6PWB  [CONN-SMD_6P-P1.25_XUNPU_WAFER-MX1.25-6PWB]  3.94 11.81 270 top
CN2  XT30UPB-M  [CONN-TH_XT30UPB-M]  37.85 41.4 0 top
D4  PMEG3015EJ,115  [SOD-323F_L1.7-W1.3-LS2.5-R-RD]  38.48 35.18 270 top
D5  PMEG3015EJ,115  [SOD-323F_L1.7-W1.3-LS2.5-R-RD]  38.48 23.24 270 top
D6  PMEG3015EJ,115  [SOD-323F_L1.7-W1.3-LS2.5-R-RD]  38.48 11.3 270 top
FPC1  1.25-4PWB  [CONN-SMD_1.25-4PWB]  24.89 40.26 180 top
FPC2  1.25-4PWB  [CONN-SMD_1.25-4PWB]  13.61 3.88 0 top
FPC3  1.25-4PWB  [CONN-SMD_1.25-4PWB]  3.85 33.24 270 top
R21  120Ω  [R0603]  7.62 33.27 270 bottom
R23  10Ω  [R0603]  20.99 21.44 270 bottom
R31  0Ω  [R0603]  15.49 35.81 0 top
R34  10Ω  [R0603]  42.68 37.81 0 top
R35  10Ω  [R0603]  41.66 27.69 180 top
R36  10Ω  [R0603]  42.68 25.89 0 top
R37  10Ω  [R0603]  41.66 15.88 180 top
R38  10Ω  [R0603]  42.68 13.92 0 top
R39  10Ω  [R0603]  41.66 3.94 180 top
R40  10kΩ  [R0603]  30.86 2.54 90 bottom
R41  100kΩ  [R0603]  30.86 5.46 90 bottom
R42  0Ω  [R0805]  35.05 2.54 90 top
SW2  TS3425BA  [SW-SMD_4P-L4.2-W3.2-P2.15-LS4.6-1]  11.31 17.3 270 top
TP1  -  [M2螺丝]  2.79 41.15 0 top
TP2  -  [M2螺丝]  2.79 2.86 0 top
TP3  -  [M2螺丝]  68.03 41.15 0 top
U1  IRSM005-301MH  [PQFN-27_IRSM005-800MHTR]  44.2 32.77 270 top
U2  IRSM005-301MH  [PQFN-27_IRSM005-800MHTR]  44.2 20.83 270 top
U3  IRSM005-301MH  [PQFN-27_IRSM005-800MHTR]  44.2 8.89 270 top
U4  STM32G431RBT6  [LQFP-64_L10.0-W10.0-P0.50-LS12.0-BL]  20.99 24.04 270 top
U5  TMCS1123B2AQDVGR  [SOIC-10_L10.3-W7.5-P1.27-LS10.3-BL]  58.01 32.93 0 top
U6  TMCS1123B2AQDVGR  [SOIC-10_L10.3-W7.5-P1.27-LS10.3-BL]  58.01 20.99 0 top
U7  TMCS1123B2AQDVGR  [SOIC-10_L10.3-W7.5-P1.27-LS10.3-BL]  58.01 9.05 0 top
U8  WAFER-MX1.25-2PWB  [CONN-SMD_2P-P1.25_XUNPU_WAFER-MX1.25-2PWB]  3.68 23.37 270 top
U10  WAFER-MX1.25-2PWB  [CONN-SMD_2P-P1.25_XUNPU_WAFER-MX1.25-2PWB]  24.38 3.68 0 top
U11  MCP2562-E/MF  [DFN-8_L3.0-W3.0-P0.65-BL-EP]  9.06 33.24 90 top
U12  AMS1117-3.3  [SOT-223-3_L6.5-W3.4-P2.30-LS7.0-BR]  12.95 15.11 180 bottom
U13  OPA237NA/3K  [SOT-23-5_L3.0-W1.7-P0.95-LS2.8-BR]  26.8 4.32 0 bottom
U91  TS34056055-0440  [SMD-4_TS34056055-0440]  67.18 32.94 90 top
U92  TS34056055-0440  [SMD-4_TS34056055-0440]  67.18 20.95 90 top
U93  TS34056055-0440  [SMD-4_TS34056055-0440]  67.18 9.14 90 top
U94  CH340N  [SOP-8_L4.9-W3.9-P1.27-LS6.0-BL]  18.16 34.54 90 bottom
USB2  MicroXNJ  [MICRO-USB-SMD_MICROXNJ]  12.95 39.37 180 top
X1  8MHz  [OSC-SMD_4P-L3.2-W2.5-BL]  11.21 25.51 270 top

## Footprints (pads in the part's own frame, mm; a bottom-side part is the same pattern mirrored in y, then rotated)
C0603
  rect 0.8x0.9 smd: 1(-0.7,0) 2(0.7,0)
CONN-SMD_1.25-4PWB
  rect 0.8x1.8 smd: 1(-1.875,1.266) 2(-0.625,1.266) 3(0.625,1.266) 4(1.875,1.266)
  rect 1.8x3.1 smd: 5(-4.425,-1.266) 6(4.425,-1.266)
CONN-SMD_2P-P1.25_XUNPU_WAFER-MX1.25-2PWB
  rect 0.7x1.7 smd: 1(-0.625,1.25) 2(0.625,1.25)
  rect 1.8x2.5 smd: 3(3.075,-1.25) 4(-3.075,-1.25)
CONN-SMD_6P-P1.25_XUNPU_WAFER-MX1.25-6PWB
  rect 0.7x1.7 smd: 1(-3.125,1.25) 2(-1.875,1.25) 3(-0.625,1.25) 4(0.625,1.25) 5(1.875,1.25) 6(3.125,1.25)
  rect 1.8x2.5 smd: 7(5.575,-1.25) 8(-5.575,-1.25)
CONN-TH_XT30UPB-M
  round 2.5 hole 1.8: 1(-2.5,0) 2(2.5,0)
DFN-8_L3.0-W3.0-P0.65-BL-EP
  rect 0.28x0.625 smd: 1(-0.975,-1.413) 2(-0.325,-1.413) 3(0.325,-1.413) 4(0.975,-1.413) 5(0.975,1.413) 6(0.325,1.413) 7(-0.325,1.413) 8(-0.975,1.413)
  rect 2.25x1.5 smd: 9(0,0)
LQFP-64_L10.0-W10.0-P0.50-LS12.0-BL
  oval 0.3x2 smd: 1(-3.75,-5.75) 2(-3.25,-5.75) 3(-2.75,-5.75) 4(-2.25,-5.75) 5(-1.75,-5.75) 6(-1.25,-5.75) 7(-0.75,-5.75) 8(-0.25,-5.75) 9(0.25,-5.75) 10(0.75,-5.75) 11(1.25,-5.75) 12(1.75,-5.75) 13(2.25,-5.75) 14(2.75,-5.75) 15(3.25,-5.75) 16(3.75,-5.75) 33(3.75,5.75) 34(3.25,5.75) 35(2.75,5.75) 36(2.25,5.75) 37(1.75,5.75) 38(1.25,5.75) 39(0.75,5.75) 40(0.25,5.75) 41(-0.25,5.75) 42(-0.75,5.75) 43(-1.25,5.75) 44(-1.75,5.75) 45(-2.25,5.75) 46(-2.75,5.75) 47(-3.25,5.75) 48(-3.75,5.75)
  oval 2x0.3 smd: 17(5.75,-3.75) 18(5.75,-3.25) 19(5.75,-2.75) 20(5.75,-2.25) 21(5.75,-1.75) 22(5.75,-1.25) 23(5.75,-0.75) 24(5.75,-0.25) 25(5.75,0.25) 26(5.75,0.75) 27(5.75,1.25) 28(5.75,1.75) 29(5.75,2.25) 30(5.75,2.75) 31(5.75,3.25) 32(5.75,3.75) 49(-5.75,3.75) 50(-5.75,3.25) 51(-5.75,2.75) 52(-5.75,2.25) 53(-5.75,1.75) 54(-5.75,1.25) 55(-5.75,0.75) 56(-5.75,0.25) 57(-5.75,-0.25) 58(-5.75,-0.75) 59(-5.75,-1.25) 60(-5.75,-1.75) 61(-5.75,-2.25) 62(-5.75,-2.75) 63(-5.75,-3.25) 64(-5.75,-3.75)
M2螺丝
  round 2 hole 2: 1(0,0)
MICRO-USB-SMD_MICROXNJ
  rect 0.4x1.6 smd: 1(-1.3,1.597) 2(-0.65,1.597) 3(0,1.597) 4(0.65,1.597) 5(1.3,1.597)
  round 1.3 hole 0.7: 6(2.425,1.074) 9(-2.425,1.073)
  oval 1.3x1.8 hole 0.7x1.1: 7(3.625,-1.597) 8(-3.625,-1.597)
OSC-SMD_4P-L3.2-W2.5-BL
  rect 1.4x1.2 smd: 1(-1.1,-0.875) 2(1.1,-0.875) 3(1.1,0.875) 4(-1.1,0.875)
PQFN-27_IRSM005-800MHTR
  rect 0.4x1.1 smd: 1(-2,-4) 2(-1.2,-4) 3(-0.4,-4) 4(0.4,-4) 5(1.2,-4) 6(2,-4) 16(1.52,4) 17(0.32,4) 18(-2.598,4)
  rect 1.1x0.4 smd: 7(3.5,-3.373) 8(3.5,-2.573) 9(3.5,-1.773) 10(3.5,-0.973) 11(3.5,0.308) 12(3.5,1.058) 13(3.5,1.808) 14(3.5,2.558) 15(3.5,3.308) 19(-3.5,3.308) 20(-3.5,2.558) 21(-3.5,1.808) 22(-3.5,1.058) 23(-3.5,0.308) 24(-3.5,-0.973) 25(-3.5,-1.773) 26(-3.5,-2.573) 27(-3.5,-3.373)
  rect 0.4x3.78 smd: 15(2.997,1.808)
  rect 2.748x4.317 smd: 17(0.92,1.538)
  rect 2.34x4.194 smd: 23(-2.027,1.6)
  rect 2.373x1.798 smd: 28(0.526,-2.173)
R0603
  rect 0.806x0.864 smd: 1(-0.753,0) 2(0.753,0)
R0805
  rect 1.133x1.377 smd: 1(-1,0) 2(1,0)
SMD-4_TS34056055-0440
  rect 3.5x2.5 smd: 1(-3.5,1.85) 2(-3.5,-1.85) 3(3.5,1.85) 4(3.5,-1.85)
SOD-323F_L1.7-W1.3-LS2.5-R-RD
  rect 0.8x0.8 smd: 1(-1.2,0) 2(1.2,0)
SOIC-10_L10.3-W7.5-P1.27-LS10.3-BL
  rect 4.6x1.12 smd: 1(-2.54,-4.732) 2(2.54,-4.732)
  rect 0.6x1.2 smd: 3(4.445,4.732) 4(3.175,4.732) 5(1.905,4.732) 6(0.635,4.732) 7(-0.635,4.732) 8(-1.905,4.732) 9(-3.175,4.732) 10(-4.445,4.732)
SOP-8_L4.9-W3.9-P1.27-LS6.0-BL
  oval 0.63x1.865 smd: 1(-1.905,-2.683) 2(-0.635,-2.683) 3(0.635,-2.683) 4(1.905,-2.683) 5(1.905,2.683) 6(0.635,2.683) 7(-0.635,2.683) 8(-1.905,2.683)
SOT-23-5_L3.0-W1.7-P0.95-LS2.8-BR
  rect 1.1x0.6 smd: 1(1.3,-0.95) 2(1.3,0) 3(1.3,0.95) 4(-1.3,0.95) 5(-1.3,-0.95)
SOT-223-3_L6.5-W3.4-P2.30-LS7.0-BR
  rect 2.5x1.1 smd: 1(2.97,-2.3) 2(2.97,0) 3(2.97,2.3)
  rect 2.34x3.6 smd: 4(-2.97,0)
SW-SMD_4P-L4.2-W3.2-P2.15-LS4.6-1
  rect 1x0.7 smd: 1(-2.25,1.075) 2(2.25,1.075) 3(-2.25,-1.075) 4(2.25,-1.075)

## Nets
As in the schematic.

Pads without a net: CN1 7 8; FPC1 5 6; FPC2 5 6; FPC3 5 6; TP1 1; TP2 1; TP3 1; U1 10; U2 10; U3 10; U4 2 3 4 8 9 10 11 12 13 14 17 26 30 38 39 40 41 45 46 51 54 55 56 57 58 59 60; U5 5 10; U6 5 10; U7 5 10; U8 3 4; U10 3 4; U94 4; USB2 4

## Via types
v1: diameter 0.61, hole 0.305, Top Layer to Bottom Layer, 206 vias

## Routing (per net, layer and track width the routed paths; a pad name or vN(x,y) marks a point on that pad's centre or on a via; arc(x,y) is an arc through that point)
GND: length 10.4
  Top Layer w0.254: v1(11.81,32.85) 11.75,32.91 U11.2 ; 14.24,5.14 v1(14.24,3.81) ; FPC3.4 v1(6.6,31.36) ; U8.2 v1(4.93,21.97) ; CN1.1 v1(6.48,14.94)
  Bottom Layer w0.254: v1(11.81,32.85) 12.73,32.85 13.07,32.51 10.31,32.51 C45.2
  vias: v1(31.32,24.77) v1(31.32,24) v1(31.32,23.24) v1(31.32,22.48) v1(31.32,12.83) v1(31.32,12.06) v1(31.32,11.3) v1(31.32,10.54) v1(53.47,30.73) v1(53.47,29.84) v1(53.47,18.8) v1(53.47,17.91) v1(53.47,6.86) v1(53.47,5.97) v1(54.23,30.73) v1(54.23,29.84) v1(54.23,18.8) v1(54.23,17.91) v1(54.23,6.86) v1(54.23,5.97) v1(54.99,30.73) v1(54.99,29.84) v1(54.99,18.8) v1(54.99,17.91) v1(54.99,6.86) v1(54.99,5.97) v1(55.75,30.73) v1(55.75,29.84) v1(55.75,18.8) v1(55.75,17.91) v1(55.75,6.86) v1(55.75,5.97)
VCC: length 42.3
  Top Layer w0.254: 23.24,18.3 23.24,20.15 v1(22.64,20.75) ; v1(54.84,35.94) U5.9 U5.8 ; U11.5 8.11,34.67 12.31,34.67 12.93,34.06 12.93,32.66 13.69,31.9 19.16,31.9 v1(19.56,31.5) ; v1(17.63,25.64) 16.91,25.64 16.64,25.91 16.64,27.56 16.4,27.79 U4.1 ; U4.48 24.74,27.79 v1(24.23,27.29) ; U7.8 U7.9 v1(54.84,11.81) ; U4.16 17.24,20.29 v1(17.63,20.68) ; v1(17.63,27.29) 17.24,27.67 U4.64 ; U6.8 U6.9 v1(54.84,24) ; v1(24.29,20.75) 24.74,20.3 24.74,18.3
  Bottom Layer w0.254: v1(25.53,6.6) 25.53,5.3 U13.5
  vias: v1(15.24,12.83) v1(15.24,12.06) v1(15.24,11.3) v1(15.24,10.54) v1(16,12.83) v1(16,12.06) v1(16,11.3) v1(16,10.54) v1(16.76,12.83) v1(16.76,12.06) v1(16.76,11.3) v1(16.76,10.54) v1(20.99,20.69)
VCC_5V: length 13.2
  Top Layer w0.254: U11.3 11.75,33.56 v1(11.81,33.63) ; 15.49,5.14 v1(15.49,3.81) ; FPC1.4 22.89,38.86 v1(20.7,38.86) ; FPC3.1 v1(6.6,35.11) ; R31.2 v1(17.78,35.81) ; CN1.2 v1(6.86,13.69)
  Bottom Layer w0.254: v1(11.81,33.63) 11.5,33.94 C45.1 ; U94.5 v1(22.61,36.45)
  vias: v1(6.98,24) v1(6.98,23.24) v1(6.98,22.48) v1(6.98,21.72) v1(6.98,20.95) v1(7.49,17.65) v1(7.49,16.89) v1(7.49,16.13) v1(7.49,15.37)
VCC_15V: length 9.9
  Top Layer w0.254: 38.48,33.15 38.48,34.01 38.52,33.97 U1.2 ; U3.2 38.52,10.09 38.48,10.13 38.48,9.27 38.68,9.07 v1(39.12,9.07) ; 38.68,32.95 v1(39.12,32.95) ; U2.2 38.55,22.03 38.48,22.09 38.48,21.23 38.68,21.04 v1(39.12,21.04) ; 38.48,33.47 38.68,33.27
  vias: v1(21.72,6.6) v1(21.72,5.59) v1(21.72,4.57) v1(22.73,6.6) v1(22.73,5.59) v1(23.75,6.6)
ADC1_IN11: length 50.7
  Top Layer w0.254: U5.6 58.65,38.63 58.42,38.86 v1(57.02,38.86) ; U4.34 28.23,20.79 28.39,20.63 v1(29.01,20.63)
  Bottom Layer w0.254: v1(29.01,20.63) 28.7,20.94 28.7,37.08 30.48,38.86 v1(57.02,38.86)
ADC1_IN12: length 41.4
  Top Layer w0.254: v1(57.02,14.86) 58.42,14.86 58.65,14.63 U7.6 ; v1(21.88,14.86) 21.24,15.49 21.24,18.3
  Bottom Layer w0.254: v1(21.88,14.86) v1(57.02,14.86)
ADC1_IN14: length 40.6
  Top Layer w0.254: U4.33 28.09,20.29 28.34,20.05 v1(28.45,20.05) ; v1(57.02,26.8) 58.42,26.8 58.65,26.57 U6.6
  Bottom Layer w0.254: v1(28.45,20.05) 29.25,20.05 29.6,20.39 29.6,21.17 29.06,21.7 29.06,26.77 29.54,27.25 31.56,27.25 32.02,26.8 v1(57.02,26.8)
ADC1_IN15: length 20.2
  Top Layer w0.254: 20.74,18.3 20.74,14.06 v1(21.84,12.95)
  Bottom Layer w0.254: U13.4 26.61,3.37 26.92,3.68 26.92,4.95 27.18,5.21 28.04,5.21 U13.1 28.1,6.7 v1(21.84,12.95)
CAN_H: length 3.7
  Top Layer w0.254: U11.7 7.13,32.91 6.83,32.61 v1(6.6,32.61) FPC3.3
  Bottom Layer w0.254: R21.2 6.7,32.52 v1(6.6,32.61)
CAN_L: length 3.7
  Top Layer w0.254: U11.6 7.08,33.56 6.78,33.86 v1(6.6,33.86) FPC3.2
  Bottom Layer w0.254: v1(6.6,33.86) 6.77,34.03 R21.1
FDCAN1_RX: length 11.7
  Top Layer w0.254: U11.4 12.27,34.21 12.57,33.91 12.57,32.51 13.54,31.54 18.37,31.54 18.74,31.17 U4.61
FDCAN1_TX: length 9.4
  Top Layer w0.254: U4.62 18.24,30.91 17.96,31.18 13.39,31.18 12.31,32.26 U11.1
HV+: length 2.4
  Bottom Layer w0.254: R41.2 v1(33.27,6.21)
  vias: v1(44.2,35.56) v1(44.2,34.29) v1(44.2,23.62) v1(44.2,22.35) v1(44.2,11.68) v1(44.2,10.41) v1(44.96,35.56) v1(44.96,34.29) v1(44.96,23.62) v1(44.96,22.35) v1(44.96,11.68) v1(44.96,10.41) v1(45.72,35.56) v1(45.72,34.29) v1(45.72,23.62) v1(45.72,22.35) v1(45.72,11.68) v1(45.72,10.41) v1(46.48,35.56) v1(46.48,34.29) v1(46.48,23.62) v1(46.48,22.35) v1(46.48,11.68) v1(46.48,10.41) v1(47.24,35.56) v1(47.24,34.29) v1(47.24,23.62) v1(47.24,22.35) v1(47.24,11.68) v1(47.24,10.41)
HV-: length 3.9
  Bottom Layer w0.254: v1(33.27,3.3) 33.27,1.91 33.16,1.79 R40.1
  vias: v1(36.32,3.81) v1(36.96,3.17) v1(44.45,28.32) v1(44.45,27.56) v1(44.45,16.38) v1(44.45,15.62) v1(44.45,4.44) v1(44.45,3.68) v1(45.21,28.32) v1(45.21,27.56) v1(45.21,16.38) v1(45.21,15.62) v1(45.21,4.44) v1(45.21,3.68) v1(45.97,28.32) v1(45.97,27.56) v1(45.97,16.38) v1(45.97,15.62) v1(45.97,4.44) v1(45.97,3.68) v1(46.74,28.32) v1(46.74,27.56) v1(46.74,16.38) v1(46.74,15.62) v1(46.74,4.44) v1(46.74,3.68) v1(47.5,28.32) v1(47.5,27.56) v1(47.5,16.38) v1(47.5,15.62) v1(47.5,4.44) v1(47.5,3.68)
NRST: length 7.6
  Top Layer w0.254: SW2.1 12.38,20 12.7,20.32 13.72,20.32 13.96,20.57 13.96,24.47 14.29,24.79 U4.7
OSC_IN: length 7.5
  Top Layer w0.254: C49.1 10.34,28.51 X1.1 11.32,25.63 12.81,25.63 12.97,25.79 U4.5
OSC_OUT: length 5.7
  Top Layer w0.254: U4.6 12.97,25.29 X1.3 12.09,22.51 C50.1
SPI1_MISO: length 22.9
  Top Layer w0.254: CN1.5 6.7,9.94 7.59,9.04 18.05,9.04 18.89,9.88 18.89,16.93 18.74,17.07 18.74,18.3
SPI1_MOSI: length 23.1
  Top Layer w0.254: 19.24,18.3 19.24,9.73 18.2,8.69 CN1.6
SPI1_NSS: length 23.5
  Top Layer w0.254: CN1.3 6.87,12.44 7.59,11.71 7.59,10.05 7.89,9.75 17.75,9.75 18.18,10.17 18.18,16.63 17.74,17.06 17.74,18.3
SPI1_SCK: length 23.3
  Top Layer w0.254: 18.24,18.3 18.24,17.06 18.53,16.78 18.53,10.03 17.9,9.4 7.74,9.4 7.24,9.9 7.24,10.8 6.85,11.19 CN1.4
SYS_JTCK-SWCLK: length 9.8
  Top Layer w0.254: FPC1.2 25.59,38.92 25.59,33.33 24.24,31.99 U4.50
SYS_JTMS-SWDIO: length 10
  Top Layer w0.254: U4.49 24.76,29.82 24.76,32 26.77,34.01 FPC1.1
TIM1_CH1: length 29.1
  Top Layer w0.254: U4.42 30.09,24.79 30.38,24.51 30.38,9.25 31.13,8.49 U3.4
TIM1_CH1N: length 26
  Top Layer w0.254: U4.35 29.17,21.29 30.02,20.45 30.02,8.59 30.92,7.69 U3.5
TIM1_CH2: length 17.8
  Top Layer w0.254: U2.4 31.13,20.43 30.73,20.83 30.73,24.77 30.2,25.29 U4.43
TIM1_CH2N: length 15.3
  Top Layer w0.254: v1(31.37,19.72) 31.46,19.63 U2.5 ; U4.36 v1(29.79,21.79)
  Bottom Layer w0.254: v1(31.37,19.72) 31.12,19.97 31.12,21.51 30.83,21.79 v1(29.79,21.79)
TIM1_CH3: length 19.6
  Top Layer w0.254: U1.4 30.97,32.37 30.73,32.13 30.73,26.29 30.24,25.79 U4.44
TIM1_CH3N: length 21.8
  Top Layer w0.254: U1.5 31.31,31.57 31.09,31.34 31.09,26.9 v1(31.32,26.67) ; v1(29.79,24.21) 29.79,22.62 29.47,22.29 U4.37
  Bottom Layer w0.254: v1(31.32,26.67) 31.32,26.11 29.79,24.59 v1(29.79,24.21)
U:
  vias: v1(43.94,30.73) v1(44.7,30.73) v1(45.47,30.73) v1(46.23,30.73) v1(46.99,30.73) v1(49.53,30.61) v1(50.29,30.61) v1(52.83,28.19)
UO:
  vias: v1(63.63,28.58) v1(63.63,27.93) v1(64.77,34.29) v1(64.77,31.75) v1(69.59,34.29) v1(69.6,31.75)
USART1_RX: length 18.9
  Top Layer w0.254: 20.24,18.3 20.24,17.07 19.96,16.78 19.96,9.44 18.49,7.97 13.82,7.97 12.99,7.14 12.99,5.14
USART1_TX: length 19.8
  Top Layer w0.254: 19.74,18.3 19.74,17.08 19.6,16.93 19.6,9.58 18.34,8.33 12.65,8.33 11.74,7.42 11.74,5.14
USART3_RX: length 6.8
  Top Layer w0.254: v1(22.48,34.67) 22.48,31.88 22.74,31.61 U4.53
  Bottom Layer w0.254: v1(22.48,34.67) 21.97,35.18 U94.6
USART3_TX: length 6.2
  Top Layer w0.254: U4.52 23.24,32.38 v1(23.24,32.39)
  Bottom Layer w0.254: v1(23.24,32.39) 23.24,33.4 22.73,33.91 U94.7
V:
  vias: v1(43.94,18.8) v1(44.7,18.8) v1(45.47,18.8) v1(46.23,18.8) v1(46.99,18.8) v1(49.53,18.67) v1(50.29,18.67) v1(52.83,16.26)
VO:
  vias: v1(63.63,16.64) v1(63.63,15.99) v1(64.77,19.81) v1(69.6,19.81)
VREF+: length 8.8
  Top Layer w0.254: v1(20.99,22.25) 21.7,22.25 21.84,22.1 21.84,20.7 22.74,19.8 22.74,18.3
  Bottom Layer w0.254: R23.1 20.86,22.33 C60.1 19.03,22.35 C59.2
W:
  vias: v1(43.94,6.86) v1(44.7,6.86) v1(45.47,6.86) v1(46.23,6.86) v1(46.99,6.86) v1(49.53,6.73) v1(50.29,6.73) v1(52.83,4.32)
WO:
  vias: v1(63.63,4.7) v1(63.63,4.05) v1(64.77,7.87) v1(69.6,7.87)
$1N2757: length 2.1
  Top Layer w0.254: C63.2 12.38,13.51 SW2.2
$1N2759: length 2.1
  Top Layer w0.254: C63.1 10.23,13.54 SW2.4
$1N4046: length 2.2
  Top Layer w0.254: USB2.1 14.25,36.3 R31.1
$1N8993: length 4.2
  Top Layer w0.254: C64.1 38.48,37.45 D4.1 38.48,35.28 38.99,34.77 ; 39.31,34.67 40.1,34.67
$1N9003: length 2.6
  Top Layer w0.254: C64.2 40.82,37.23 U1.27 U1.26
$1N9475: length 2.6
  Top Layer w0.254: U2.26 U2.27 40.82,25.31 C65.2
$1N9480: length 4.6
  Top Layer w0.254: U2.1 39.02,22.83 38.48,23.36 D5.1 38.48,25.53 C65.1
$1N9569: length 2.6
  Top Layer w0.254: U3.26 U3.27 40.82,13.34 C66.2
$1N9574: length 4.6
  Top Layer w0.254: U3.1 39.02,10.89 38.48,11.43 D6.1 38.48,13.56 C66.1
$1N9829: length 1.7
  Top Layer w0.254: R34.1 42.42,37.32 U1.25
$1N9852: length 1.6
  Top Layer w0.254: 43.22,36.27 43.22,37.59 R34.2
$1N9858: length 1.6
  Top Layer w0.254: R35.2 40.82,27.77 U1.7
$1N9862: length 1.6
  Top Layer w0.254: U1.9 42.42,27.7 R35.1
$1N9872: length 1.8
  Top Layer w0.254: U2.25 42.42,25.4 R36.1
$1N9876: length 1.7
  Top Layer w0.254: 43.22,24.33 43.22,25.68 R36.2
$1N9891: length 1.5
  Top Layer w0.254: U2.7 40.82,15.95 R37.2
$1N9895: length 1.5
  Top Layer w0.254: U2.9 42.42,15.89 R37.1
$1N9905: length 1.5
  Top Layer w0.254: U3.7 40.82,4.02 R39.2
$1N9909: length 1.5
  Top Layer w0.254: R39.1 42.42,3.95 U3.9
$1N9916: length 1.7
  Top Layer w0.254: R38.1 42.42,13.43 U3.25
$1N9921: length 1.6
  Top Layer w0.254: 43.22,12.39 43.22,13.71 R38.2
$1N13308: length 4.2
  Bottom Layer w0.254: R41.1 R40.2 30.79,3.37 U13.3
$1N17919: length 7.1
  Top Layer w0.254: USB2.3 v1(12.95,35.69)
  Bottom Layer w0.254: U94.1 13.97,32.64 12.95,33.66 v1(12.95,35.69)
$1N17922: length 5.5
  Top Layer w0.254: USB2.2 v1(13.6,36.19)
  Bottom Layer w0.254: U94.2 14.1,33.91 13.6,34.4 v1(13.6,36.19)
$1N18063: length 2.9
  Bottom Layer w0.254: C67.2 20.84,29.76 U94.8

## Copper pours and planes (outline as drawn; the poured copper is in the pictures)
GND on Top Layer: 0,44.07 70.99,44.07 70.99,0 0,0
GND on Bottom Layer: 0,44.2 70.99,44.2 70.99,0.13 0,0.13
GND on Inner1: 0,44.07 30.28,44.07 30.78,43.57 30.78,0.4 30.38,0 0,0
VCC on Bottom Layer: 8.51,15.62 8.64,15.75 13.97,15.75 14.22,16 14.22,17.02 14.35,17.14 17.14,17.14 17.27,17.02 17.27,10.29 17.02,10.03 13.33,10.03 13.21,10.16 13.21,14.35 13.08,14.48 8.64,14.48 8.51,14.61
VCC on Inner2: 19.81,0.13 19.56,0.38 19.56,6.48 19.43,6.6 13.46,6.6 13.21,6.86 13.21,32 13.46,32.26 28.2,32.26 28.7,31.75 28.7,2.54 28.96,2.29 60.2,2.29 60.45,2.54 60.45,10.54 60.32,10.67 54.48,10.67 54.23,10.92 54.23,12.7 54.48,12.95 60.32,12.95 60.45,13.08 60.45,22.73 60.32,22.86 54.48,22.86 54.23,23.11 54.23,24.64 54.48,24.89 60.32,24.89 60.45,25.02 60.45,34.54 60.32,34.67 54.48,34.67 54.23,34.92 54.23,36.45 54.46,36.68 62.89,36.68 63.12,36.45 63.12,0.51 62.74,0.13
VCC_5V on Top Layer: 3.81,24.38 3.94,24.51 7.37,24.51 7.49,24.38 7.49,20.7 7.37,20.57 6.22,20.57 6.1,20.7 6.1,23.24 5.97,23.37 3.94,23.37 3.81,23.5
VCC_5V on Bottom Layer: 11.05,18.29 11.3,18.54 11.3,19.94 11.43,20.07 12.83,20.07 12.95,19.94 12.95,16.64 12.83,16.51 8.38,16.51 8.25,16.38 8.25,15.11 8,14.86 7.11,14.86 6.86,15.11 6.86,18.03 7.11,18.29
VCC_5V on Inner2: 28.22,44.07 28.7,43.58 28.7,32.89 28.19,32.39 13.33,32.39 13.08,32.13 13.08,6.73 13.33,6.48 19.18,6.48 19.43,6.22 19.43,0.4 19.03,0 0,0 0,44.07
VCC_15V on Top Layer: 24.38,4.19 24.38,6.98 24.13,7.24 21.34,7.24 21.08,6.98 21.08,4.19 21.34,3.94 24.13,3.94
VCC_15V on Inner3: 21.21,0.25 21.08,0.38 21.08,6.98 21.34,7.24 24.13,7.24 24.38,6.98 24.38,2.41 24.51,2.29 57.4,2.29 57.66,2.54 57.66,7.11 57.4,7.37 38.86,7.37 38.74,7.49 38.74,9.4 38.86,9.53 57.4,9.53 57.66,9.78 57.66,19.05 57.4,19.3 38.86,19.3 38.74,19.43 38.74,21.34 38.86,21.46 57.4,21.46 57.66,21.72 57.66,30.99 57.4,31.24 38.86,31.24 38.74,31.37 38.74,33.27 38.86,33.4 60.07,33.4 60.32,33.15 60.32,0.51 60.07,0.25
HV+ on Bottom Layer: 47.89,24.03 41.3,24.03 41.15,23.88 41.15,21.84 41.28,21.72 47.88,21.72 48.01,21.84 48.01,23.91
HV+ on Bottom Layer: 47.89,35.96 41.3,35.96 41.15,35.81 41.15,33.78 41.28,33.66 47.88,33.66 48.01,33.78 48.01,35.85
HV+ on Bottom Layer: 47.89,12.09 41.3,12.09 41.15,11.94 41.15,9.91 41.28,9.78 47.88,9.78 48.01,9.91 48.01,11.97
HV+ on Inner2: 38.86,39.24 38.61,38.99 38.61,37.21 38.86,36.96 48.64,36.96 48.9,36.7 48.9,33.78 48.64,33.53 38.86,33.53 38.61,33.27 38.61,25.27 38.86,25.02 48.64,25.02 48.9,24.77 48.9,21.84 48.64,21.59 38.86,21.59 38.61,21.34 38.61,13.33 38.86,13.08 48.64,13.08 48.9,12.83 48.9,9.91 48.64,9.65 38.86,9.65 38.61,9.4 38.61,3.56 37.85,2.79 32.77,2.79 32,3.56 32,43.05 32.51,43.56 43.43,43.56 43.94,43.05 43.94,39.75 43.43,39.24
HV+ on Inner2: 38.86,39.24 38.61,38.99 38.61,37.21 38.86,36.96 48.64,36.96 48.9,36.7 48.9,33.78 48.64,33.53 38.86,33.53 38.61,33.27 38.61,25.27 38.86,25.02 48.64,25.02 48.9,24.77 48.9,21.84 48.64,21.59 38.86,21.59 38.61,21.34 38.61,13.33 38.86,13.08 48.64,13.08 48.9,12.83 48.9,9.91 48.64,9.65 38.86,9.65 38.61,9.4 38.61,3.56 38.1,3.05 32.51,3.05 32,3.56 32,43.05 32.51,43.56 43.43,43.56 43.94,43.05 43.94,39.75 43.43,39.24
HV+ on Inner2: 32,43.05 32.51,43.56 38.1,43.56 38.61,43.05 38.61,37.21 38.86,36.96 48.64,36.96 48.9,36.7 48.9,33.78 48.64,33.53 38.86,33.53 38.61,33.27 38.61,25.27 38.86,25.02 48.64,25.02 48.9,24.77 48.9,21.84 48.64,21.59 38.86,21.59 38.61,21.34 38.61,13.33 38.86,13.08 48.64,13.08 48.9,12.83 48.9,9.91 48.64,9.65 38.86,9.65 38.61,9.4 38.61,3.56 38.1,3.05 32.51,3.05 32,3.56
HV+ on Inner4: 38.86,39.24 38.61,38.99 38.61,37.21 38.86,36.96 48.64,36.96 48.9,36.7 48.9,33.78 48.64,33.53 38.86,33.53 38.61,33.27 38.61,25.27 38.86,25.02 48.64,25.02 48.9,24.77 48.9,21.84 48.64,21.59 38.86,21.59 38.61,21.34 38.61,13.33 38.86,13.08 48.64,13.08 48.9,12.83 48.9,9.91 48.64,9.65 38.86,9.65 38.61,9.4 38.61,3.56 37.85,2.79 32.77,2.79 32,3.56 32,43.05 32.51,43.56 43.43,43.56 43.94,43.05 43.94,39.75 43.43,39.24
HV- on Top Layer: 43.94,6.1 44.07,6.22 47.88,6.22 48.01,6.1 48.01,2.92 47.88,2.79 44.07,2.79 43.94,2.92
HV- on Top Layer: 43.94,18.03 44.07,18.16 47.88,18.16 48.01,18.03 48.01,14.86 47.88,14.73 44.07,14.73 43.94,14.86
HV- on Top Layer: 34.29,4.06 34.42,4.19 37.21,4.19 37.34,4.06 37.34,2.92 37.21,2.79 34.42,2.79 34.29,2.92
HV- on Top Layer: 43.94,29.97 44.07,30.1 47.88,30.1 48.01,29.97 48.01,26.8 47.88,26.67 44.07,26.67 43.94,26.8
HV- on Bottom Layer: 48.01,3.43 47.88,3.3 44.07,3.3 43.94,3.43 43.94,6.1 44.07,6.22 47.88,6.22
HV- on Bottom Layer: 48.01,15.37 47.88,15.24 44.07,15.24 43.94,15.37 43.94,18.03 44.07,18.16 47.88,18.16
HV- on Bottom Layer: 48.01,27.31 47.88,27.18 44.07,27.18 43.94,27.31 43.94,29.97 44.07,30.1 47.88,30.1
HV- on Inner1: 43.43,43.56 43.94,43.05 43.94,39.75 43.43,39.24 38.86,39.24 38.61,38.99 38.61,30.35 38.86,30.1 48.64,30.1 48.9,29.84 48.9,26.92 48.64,26.67 38.86,26.67 38.61,26.42 38.61,18.42 38.86,18.16 48.64,18.16 48.9,17.91 48.9,14.99 48.64,14.73 38.86,14.73 38.61,14.48 38.61,6.48 38.86,6.22 48.64,6.22 48.9,5.97 48.9,3.05 48.64,2.79 32.77,2.79 32,3.56 32,43.05 32.51,43.56
HV- on Inner3: 43.43,43.56 43.94,43.05 43.94,39.75 43.43,39.24 38.86,39.24 38.61,38.99 38.61,30.35 38.86,30.1 48.64,30.1 48.9,29.84 48.9,26.92 48.64,26.67 38.86,26.67 38.61,26.42 38.61,18.42 38.86,18.16 48.64,18.16 48.9,17.91 48.9,14.99 48.64,14.73 38.86,14.73 38.61,14.48 38.61,6.48 38.86,6.22 48.64,6.22 48.9,5.97 48.9,3.05 48.64,2.79 32.77,2.79 32,3.56 32,43.05 32.51,43.56
U on Top Layer: 43.43,33.15 43.56,33.27 51.94,33.27 52.07,33.15 52.07,28.96 52.2,28.83 57.78,28.83 57.91,28.7 57.91,27.69 57.78,27.56 49.28,27.56 49.15,27.69 49.15,30.1 48.9,30.35 43.56,30.35 43.43,30.48
U on Bottom Layer: 41.15,33.15 41.28,33.27 47.88,33.27 48.01,33.15 48.01,30.48 47.88,30.35 41.28,30.35 41.15,30.48
U on Inner1: 43.43,33.15 43.56,33.27 51.94,33.27 52.07,33.15 52.07,28.96 52.2,28.83 57.78,28.83 57.91,28.7 57.91,27.69 57.78,27.56 49.28,27.56 49.15,27.69 49.15,30.1 48.9,30.35 43.56,30.35 43.43,30.48
UO on Top Layer: 58.17,28.7 58.29,28.83 63.63,28.83 63.88,29.08 63.88,38.23 64.01,38.35 70.36,38.35 70.49,38.23 70.49,27.69 70.36,27.56 58.29,27.56 58.17,27.69
UO on Inner1: 58.17,28.7 58.29,28.83 63.63,28.83 63.88,29.08 63.88,38.23 64.01,38.35 70.36,38.35 70.49,38.23 70.49,27.69 70.36,27.56 58.29,27.56 58.17,27.69
V on Top Layer: 43.43,21.21 43.56,21.34 51.94,21.34 52.07,21.21 52.07,17.02 52.2,16.89 57.78,16.89 57.91,16.76 57.91,15.75 57.78,15.62 49.28,15.62 49.15,15.75 49.15,18.16 48.9,18.42 43.56,18.42 43.43,18.54
V on Bottom Layer: 41.15,21.21 41.28,21.34 47.88,21.34 48.01,21.21 48.01,18.54 47.88,18.42 41.28,18.42 41.15,18.54
V on Inner1: 43.43,21.21 43.56,21.34 51.94,21.34 52.07,21.21 52.07,17.02 52.2,16.89 57.78,16.89 57.91,16.76 57.91,15.75 57.78,15.62 49.28,15.62 49.15,15.75 49.15,18.16 48.9,18.42 43.56,18.42 43.43,18.54
VO on Top Layer: 58.17,16.76 58.29,16.89 63.63,16.89 63.88,17.14 63.88,26.29 64.01,26.42 70.36,26.42 70.49,26.29 70.49,15.75 70.36,15.62 58.29,15.62 58.17,15.75
VO on Inner1: 58.17,16.76 58.29,16.89 63.63,16.89 63.88,17.14 63.88,26.29 64.01,26.42 70.36,26.42 70.49,26.29 70.49,15.75 70.36,15.62 58.29,15.62 58.17,15.75
W on Top Layer: 43.43,9.27 43.56,9.4 51.94,9.4 52.07,9.27 52.07,5.08 52.2,4.95 57.78,4.95 57.91,4.83 57.91,3.81 57.78,3.68 49.28,3.68 49.15,3.81 49.15,6.22 48.9,6.48 43.56,6.48 43.43,6.6
W on Bottom Layer: 41.15,9.27 41.28,9.4 47.88,9.4 48.01,9.27 48.01,6.6 47.88,6.48 41.28,6.48 41.15,6.6
W on Inner1: 43.43,9.27 43.56,9.4 51.94,9.4 52.07,9.27 52.07,5.08 52.2,4.95 57.78,4.95 57.91,4.83 57.91,3.81 57.78,3.68 49.28,3.68 49.15,3.81 49.15,6.22 48.9,6.48 43.56,6.48 43.43,6.6
WO on Top Layer: 58.17,4.83 58.29,4.95 63.63,4.95 63.88,5.21 63.88,14.35 64.01,14.48 70.36,14.48 70.49,14.35 70.49,3.81 70.36,3.68 58.29,3.68 58.17,3.81
WO on Inner1: 58.17,4.83 58.29,4.95 63.63,4.95 63.88,5.21 63.88,14.35 64.01,14.48 70.36,14.48 70.49,14.35 70.49,3.81 70.36,3.68 58.29,3.68 58.17,3.81

## Text on the board
Top Silkscreen Layer: SW | 15V | 5V | SWD | CAN | SPI
